# Altium schematic sheet NapajanjeGIT.SchDoc
size A2; SheetNumber: 2; SheetTotal: 2; SPICEModelCacheRCYDMWHU: <root> / <DocumentId>RCYDMWHU</DocumentId> / <CacheFrame Number="0"> / <Model Name="1n4001" Kind="MDL"> / <Text>*1N4001 MCE 8-16-95 / *50V 1A Si GenPurpose Diode pkg:DIODE0.4 1,2 / .MODEL 1N4001 D(IS=2.55E-9 RS=0.042 N=1.75 TT=5.76E-6 CJO=1.85E-11 / + VJ=0.75 M=0.333 BV=50 IBV=1E-5 )</Text> / </Model> / <Model Name="led1" Kind="MDL"> / <Text>*Typ RED GaAs LED: Vf=1.7V Vr=4V If=40mA trr=3uS / *LED Pinout: 1=A, 2=K / .MODEL LED1 D (IS=93.2P RS=42M N=3.73 BV=4 IBV=10U / + CJO=2.97P VJ=.75 M=.333 TT=4.32U)</Text> / </Model> / </CacheFrame> / </root>
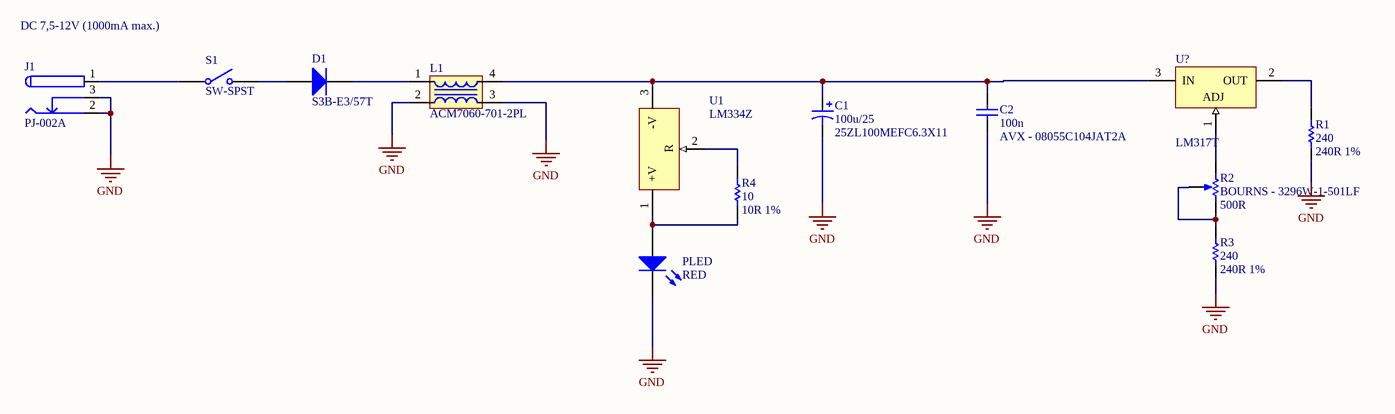
[diagram p0: NapajanjeGIT.SchDoc]

## Parts
C1  25ZL100MEFC6.3X11  value 100u/25  [CAPPR2.5-6.3x11]
C2  AVX - 08055C104JAT2A  value 100n  [CAPC2012N]
D1  S3B-E3/57T  [DIODE_SMC]
J1  PJ-002A  [PJ-002A]
L1  ACM7060-701-2PL  [ACM7060-701-2PL]
PLED  RED  [MOLEX_22272021]
R1  240R 1%  value 240  [AXIAL-0.3]
R2  BOURNS - 3296W-1-501LF  value 500R  [VR5]
R3  240R 1%  value 240  [AXIAL-0.3]
R4  10R 1%  value 10  [AXIAL-0.3]
S1  SW-SPST  [MOLEX_22272021]
U1  LM334Z  [Z03A]
U?  LM317T  [TO-220]

## Nets
GND: C1.2 C2.1 J1.2 J1.3 L1.2 L1.3 PLED.2(K) R1.1 R3.1
NetC1_1: C1.1 C2.2 L1.4 U1.3(-V) U?.3(IN)
NetD1_1: D1.1(A) S1.2(NO)
NetD1_2: D1.2(K) L1.1
NetJ1_1: J1.1 S1.1(COMMON)
NetPLED_1: PLED.1(A) R4.1 U1.1(+V)
NetR1_2: R1.2 U?.2(OUT)
NetR2_1: R2.1(TOP) U?.1(ADJ)
NetR2_2: R2.2(BOT) R2.3(TAP) R3.2
NetR4_2: R4.2 U1.2(R)

## Notes on the sheet
- DC 7,5-12V (1000mA max.)

## Library data of the parts
C1 = Cap Pol1: Polarized Capacitor (Radial); Name: Farnell; Value1: 1144697; Published: 8-Jun-2000; LatestRevisionDate: 17-Jul-2002; LatestRevisionNote: Re-released for DXP Platform.; PackageReference: RB7.6-15; Publisher: Altium Limited; PackageDescription: Polarized Capacitor (Radial); 2 Leads
C2 = Cap: Capacitor; Name: Farnell; Value1: 1740673; Published: 8-Jun-2000; LatestRevisionDate: 17-Jul-2002; LatestRevisionNote: Re-released for DXP Platform.; PackageReference: RAD-0.3; Publisher: Altium Limited; PackageDescription: Radial Cap, Thru-Hole; 2 Leads; 0.3 in Pin Spacing
D1 = Diode 1N4001: 1 Amp General Purpose Rectifier; Published: 8-Jun-2000; LatestRevisionDate: 17-Jul-2002; LatestRevisionNote: Re-released for DXP Platform.; DatasheetVersion: 1998; PackageVersion: Aug-1999; PackageReference: DO-41; Publisher: Altium Limited; PackageDescription: Diode, Axial; Body 5.2 x 2.7 mm (LxDia. max), Lead Dia. 0.86 mm (max); Code_JEDEC: DO-204-AL; ComponentLink1Description: Manufacturer Link; ComponentLink1URL: http://www.fairchildsemi.com/; ComponentLink2Description: Datasheet; ComponentLink2URL: http://www.fairchildsemi.com/ds/1N%2F1N4001.pdf
J1 = PJ-002A: DC Power Jack 2.1 mm; ComponentLink1Description: Manufacturer link; ComponentLink1URL: http://http://www.cui.com/
L1 = CHOKE, COMMON MODE: Common Mode Filter For Power Line; Name: Farnell; Value: 1503724
PLED = LED1: Typical RED GaAs LED; Published: 8-Jun-2000; LatestRevisionDate: 08-Jul-2005; LatestRevisionNote: Mech Layer 1 removed.; PackageReference: LED-1; Publisher: Altium Limited; PackageDescription: LED; 2 Leads
R1 R3 R4 = Res1: Resistor; Published: 8-Jun-2000; LatestRevisionDate: 17-Jul-2002; LatestRevisionNote: Re-released for DXP Platform.; PackageReference: AXIAL-0.3; Publisher: Altium Limited; PackageDescription: Axial Device, Thru-Hole; 2 Leads; 0.3 in Pin Spacing
R2 = RPot: TRIMMER, 25 TURN 500R; Sim Note: Enter the Resistance value and the set point into parameter fields.; Set Position: 0.5; Name: Farnell; Value*: 1754172; Published: 8-Jun-2000; LatestRevisionDate: 17-Jul-2002; LatestRevisionNote: Re-released for DXP Platform.; PackageReference: VR5; Publisher: Altium Limited; PackageDescription: Variable Resistor, Thru-Hole; 3 Leads
S1 = SW-SPST: Single-Pole, Single-Throw Switch; Published: 24-Mar-1999; LatestRevisionDate: 17-Jul-2002; LatestRevisionNote: Re-released for DXP Platform.; PackageReference: SPST-2; Publisher: Altium Limited; PackageDescription: Switch; 2 Leads
U1 = LM334Z: 3-Terminal Adjustable Current Source, 3-pin TO-92; Manufacturer: National Semiconductor; PackageTopMarking: NSXYTT*LM334*Z; PowerWise: N; CompType: MiscPower; Published: 4-Dec-2008; DatasheetVersion: Mar-2005; PackageVersion: revG, Sep-2000; PackageReference: Z03A; Publisher: Altium Limited; PackageDescription: TO-92, Molded, 3 Lead; Supplier 1: Farnell; Supplier Part Number 1: 9488065; PartNumber: LM334Z; RoHS: N; PinCount: 3; Code_JEDEC: TO-226-AA; ComponentLink1Description: LM334 Datasheet; ComponentLink1URL: http://www.national.com/ds/LM/LM334.pdf; ComponentLink2Description: LM334 Web Page; ComponentLink2URL: http://www.national.com/pf/LM/LM334.html; ComponentLink3Description: Z03A Package Page; ComponentLink3URL: http://www.national.com/packaging/folders/z03a.html
U? = LM317T: TO-220 with heatsink mounted; Manufacturer: National Semiconductor; PackageTopMarking: NSUZXYTTE#*LM317T P+; PowerWise: N; CompType: LDO IC; Published: 4-Dec-2008; DatasheetVersion: Apr-2007; PackageVersion: revL, Jan-1992; PackageReference: T03B; Publisher: Altium Limited; PackageDescription: TO-220, Molded, 3 Lead, Straight; Supplier 1: Farnell; Supplier Part Number 1: 1523842; PartNumber: LM317T; RoHS: N; PinCount: 3; ComponentLink1Description: LM317 Datasheet; ComponentLink1URL: http://www.national.com/ds/LM/LM317.pdf; ComponentLink2Description: LM317 Web Page; ComponentLink2URL: http://www.national.com/pf/LM/LM317.html; ComponentLink3Description: T03B Package Page; ComponentLink3URL: http://www.national.com/packaging/folders/t03b.html